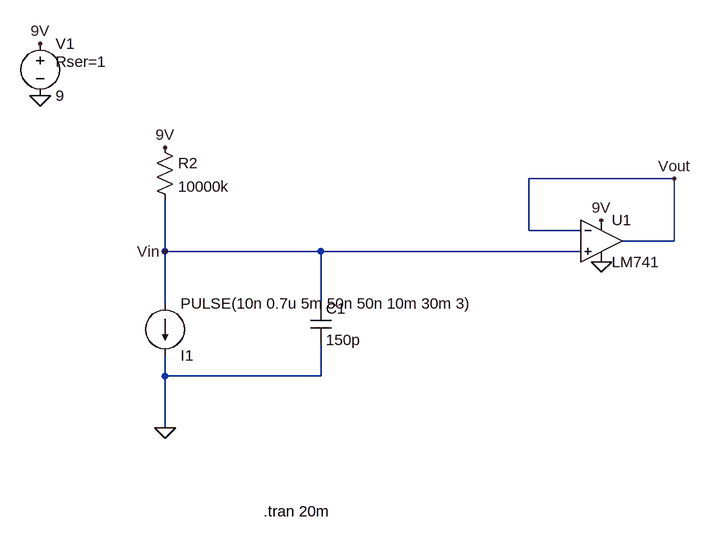
[diagram p0: schematic photodiode no amp.asc]
photodiode no amp.asc, the LTspice schematic file:
Version 4
SHEET 1 880 680
WIRE 768 -288 544 -288
WIRE 544 -208 544 -288
WIRE 624 -208 544 -208
WIRE 768 -192 768 -288
WIRE 768 -192 688 -192
WIRE -16 -176 -16 -256
WIRE 224 -176 -16 -176
WIRE 624 -176 224 -176
WIRE -16 -96 -16 -176
WIRE 224 -96 224 -176
WIRE -16 16 -16 -16
WIRE 224 16 224 -32
WIRE 224 16 -16 16
WIRE -16 96 -16 16
FLAG -16 96 0
FLAG -208 -416 0
FLAG -208 -496 9V
FLAG -16 -336 9V
FLAG 656 -224 9V
FLAG 656 -160 0
FLAG 768 -288 Vout
FLAG -16 -176 Vin
SYMBOL current -16 -96 R0
WINDOW 0 24 80 Left 2
WINDOW 3 24 0 Left 2
WINDOW 123 0 0 Left 0
WINDOW 39 0 0 Left 0
SYMATTR InstName I1
SYMATTR Value PULSE(10n 0.7u 5m 50n 50n 10m 30m 3)
SYMBOL cap 208 -96 R0
SYMATTR InstName C1
SYMATTR Value 150p
SYMBOL OpAmps\\LM741 656 -256 R0
SYMATTR InstName U1
SYMBOL voltage -208 -512 R0
WINDOW 123 0 0 Left 0
WINDOW 39 24 44 Left 2
SYMATTR SpiceLine Rser=1
SYMATTR InstName V1
SYMATTR Value 9
SYMBOL res -32 -352 R0
SYMATTR InstName R2
SYMATTR Value 10000k
TEXT 136 224 Left 2 !.tran 20m

The netlist it stands for:
* photodiode no amp.asc
I1 Vin 0 PULSE(10n 0.7u 5m 50n 50n 10m 30m 3)
C1 Vin 0 150p
XU1 Vin Vout 9V 0 Vout LM741  ; pins In+ In- V+ V- OUT
V1 9V 0 9 Rser=1
R2 9V Vin 10000k
.tran 20m
.lib LM741.lib
.backanno
.end

* Results of the author's LTspice run, read from the files saved beside the schematic
* Operating Point, zero values left out:
*   V(vin) = 7.99 V
*   V(vout) = 7.981 V
*   V(9v) = 8.999 V
*   I(I1) = 10 nA
*   I(R2) = 100.9 nA
*   I(V1) = -1.439 mA
*   Ix(u1:1) = 90.89 nA
*   Ix(u1:2) = 68.86 nA
*   Ix(u1:99) = 1.439 mA
*   Ix(u1:50) = -1.439 mA
*   Ix(u1:28) = -68.86 nA
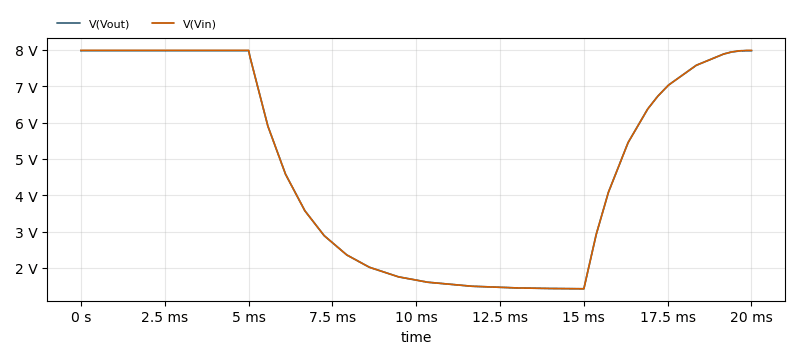
[diagram p1: Transient Analysis of photodiode no amp.asc, plotted from the saved traces]
* Transient Analysis, 1 run:
*   V(Vout): min 1.428 V, max 7.981 V, average 4.78 V, rms 5.547 V, last 7.981 V
*   V(Vin): min 1.427 V, max 7.99 V, average 4.781 V, rms 5.55 V, last 7.989 V